# Altium project Timingcard_PROJECT.PrjPcb
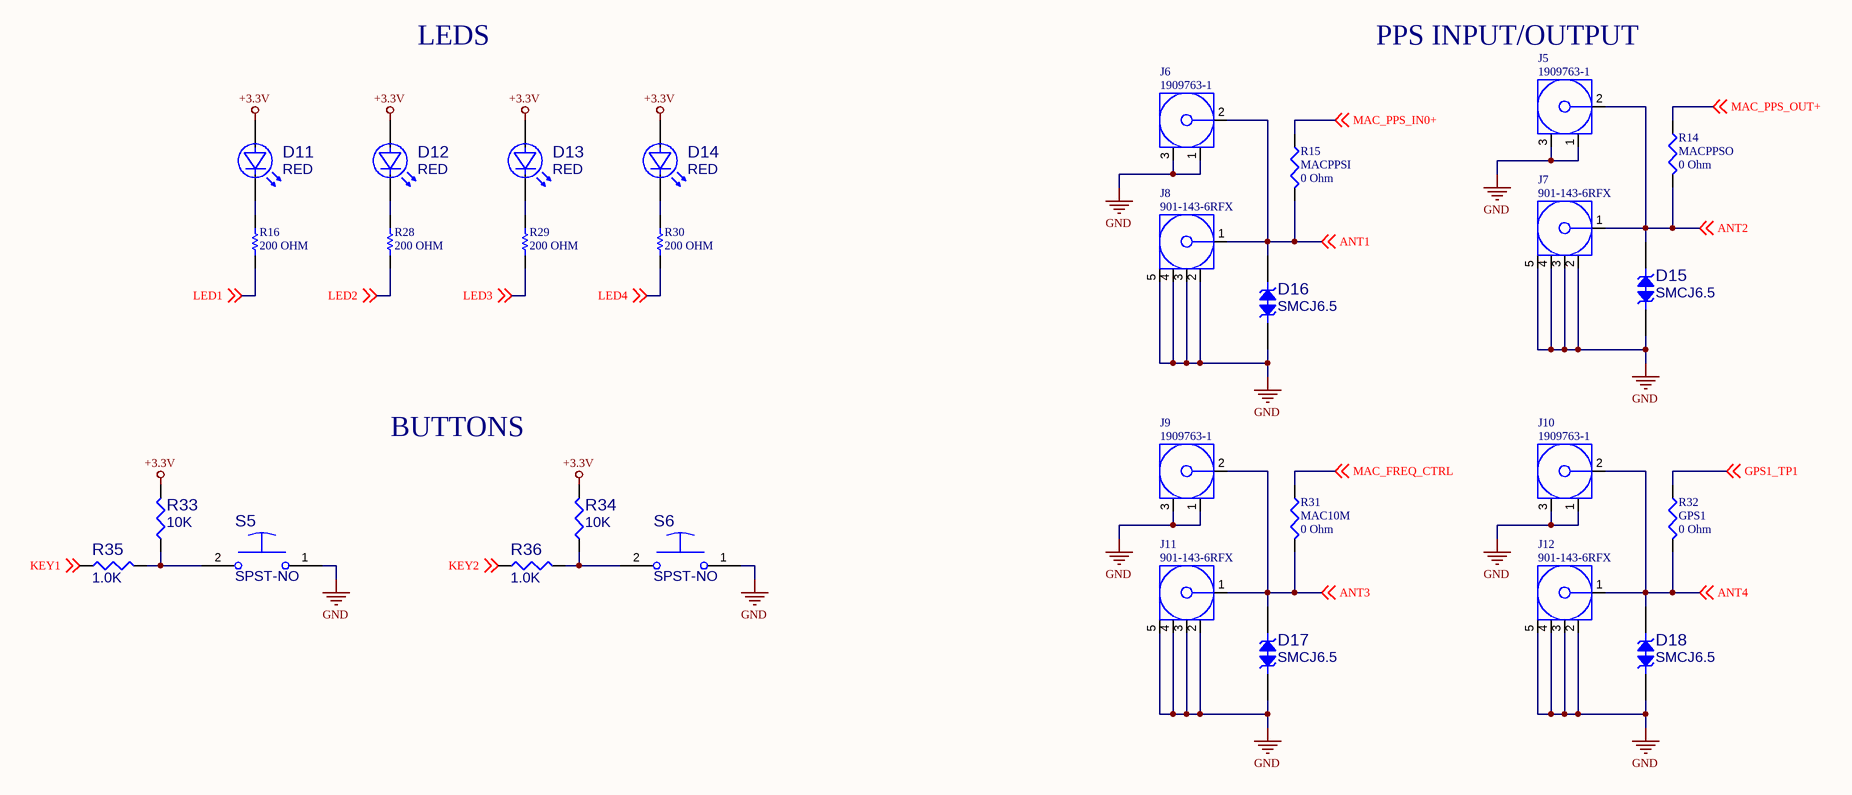
[diagram p0: USER_IO.SchDoc]
4 sheets, 106 parts. Net scope: global (net labels, ports and power ports of the same name join across sheets).
Board file: Timingcard_PCB.PcbDoc
Sheets:
  USER_IO.SchDoc
  POWER.SchDoc
  MAC.SchDoc
  FPGA.SchDoc

## Sheet USER_IO.SchDoc
size Tabloid; SheetNumber: 1; SheetTotal: 7

### Parts
D11  RED  [DIOM1608X06N]
D12  RED  [DIOM1608X06N]
D13  RED  [DIOM1608X06N]
D14  RED  [DIOM1608X06N]
D15  value SMCJ6.5  [DIOM6959X26N]  (hidden comment: SMCJ6.5CA)
D16  value SMCJ6.5  [DIOM6959X26N]  (hidden comment: SMCJ6.5CA)
D17  value SMCJ6.5  [DIOM6959X26N]  (hidden comment: SMCJ6.5CA)
D18  value SMCJ6.5  [DIOM6959X26N]  (hidden comment: SMCJ6.5CA)
J5  1909763-1  [TECO-1909763-1_V]
J6  1909763-1  [TECO-1909763-1_V]
J7  901-143-6RFX  [AMPH-901-143-6RFX_V]
J8  901-143-6RFX  [AMPH-901-143-6RFX_V]
J9  1909763-1  [TECO-1909763-1_V]
J10  1909763-1  [TECO-1909763-1_V]
J11  901-143-6RFX  [AMPH-901-143-6RFX_V]
J12  901-143-6RFX  [AMPH-901-143-6RFX_V]
R14  MACPPSO  value 0 Ohm  [J1-0603]
R15  MACPPSI  value 0 Ohm  [J1-0603]
R16  200 OHM  [RESC1608X55X30NL15T15]
R28  200 OHM  [RESC1608X55X30NL15T15]
R29  200 OHM  [RESC1608X55X30NL15T15]
R30  200 OHM  [RESC1608X55X30NL15T15]
R31  MAC10M  value 0 Ohm  [J1-0603]
R32  GPS1  value 0 Ohm  [J1-0603]
R33  value 10K  [RESC1608X50N]  (hidden comment: ERJ-3EKF1002V)
R34  value 10K  [RESC1608X50N]  (hidden comment: ERJ-3EKF1002V)
R35  value 1.0K  [RESC1608X50N]  (hidden comment: ERJ-3EKF1001V)
R36  value 1.0K  [RESC1608X50N]  (hidden comment: ERJ-3EKF1001V)
S5  value SPST-NO  [OMRON-B3U-1000P]  (hidden comment: B3U-1000P)
S6  value SPST-NO  [OMRON-B3U-1000P]  (hidden comment: B3U-1000P)

### Nets
+3.3V: D11.2(A) D12.2(A) D13.2(A) D14.2(A) R33.2 R34.2
GND: D15.K D16.K D17.K D18.K J5.1 J5.3 J6.1 J6.3 J7.2 J7.3 J7.4 J7.5 J8.2 J8.3 J8.4 J8.5 J9.1 J9.3 J10.1 J10.3 J11.2 J11.3 J11.4 J11.5 J12.2 J12.3 J12.4 J12.5 S5.1 S6.1
ANT1: D16.A J6.2 J8.1 R15.2 ; off-sheet ANT1
ANT2: D15.A J5.2 J7.1 R14.2 ; off-sheet ANT2
ANT3: D17.A J9.2 J11.1 R31.2 ; off-sheet ANT3
ANT4: D18.A J10.2 J12.1 R32.2 ; off-sheet ANT4
GPS1_TP1: R32.1 ; off-sheet GPS1_TP1
KEY1: R35.1 ; off-sheet KEY1
KEY2: R36.1 ; off-sheet KEY2
LED1: R16.1 ; off-sheet LED1
LED2: R28.1 ; off-sheet LED2
LED3: R29.1 ; off-sheet LED3
LED4: R30.1 ; off-sheet LED4
MAC_FREQ_CTRL: R31.1 ; off-sheet MAC_FREQ_CTRL  [project net MAC_10Mout]
MAC_PPS_IN0+: R15.1 ; off-sheet MAC_PPS_IN0+
MAC_PPS_OUT+: R14.1 ; off-sheet MAC_PPS_OUT+
NetD11_1: D11.1(K) R16.2
NetD12_1: D12.1(K) R28.2
NetD13_1: D13.1(K) R29.2
NetD14_1: D14.1(K) R30.2
NetR33_1: R33.1 R35.2 S5.2
NetR34_1: R34.1 R36.2 S6.2

### Notes on the sheet
- LEDS
- PPS INPUT/OUTPUT
- BUTTONS
- SHEET
- timingcard.com <http://timingcard.com>
- OF

### Library data of the parts
D11-D14 = SMTLED_RED_0603_SML: LED, RED, SML-LX0603, 635NM, 2V, 20MA, 0603; MFG PART NUM: SML-LX0603IW-TR; VALENTIUM PART NUM: <VALENTIUM>; MFG NAME: LUMEX; MAXTEMP: 85C; MINTEMP: -25C; MODIFY DATE: 9/4/2013; CATEGORY: LED; OTHER: SML-LX0603; P1: 635NM; P2: 2V; P3: 20MA; SIZE: 0603; SHEETPART: *; DESC: LED, RED, SML-LX0603, 635NM, 2V, 20MA, 0603; Supplier 1: Digi-Key; Supplier Part Number 1: 67-1548-1-ND; VALUE: RED
D15-D18 = SMCJ6.5CA: DIO, TVS, SMCJ6.5, 6.5V, BIDIR, 1.5KW, SMC; VALENTIUM PART NUM: <VALENTIUM>; MFG NAME: LITTELFUSE; MAXTEMP: 150C; MINTEMP: -55C; OTHER: SMCJ; MFG PART NUM: SMCJ6.5CA; MODIFY DATE: 9/4/2013; CATEGORY: DIO, TVS; P1: 6.5V; P2: BIDIR; P3: 1.5KW; SIZE: SMC; SHEETPART: *; Supplier 1: Digi-Key; Supplier Part Number 1: SMCJ6.5CALFCT-ND; DESC: DIO, TVS, SMCJ6.5, 6.5V, BIDIR, 1.5KW, SMC
J5 J6 J9 J10 = CMP-2000-07505-1: Ultra Miniature Coaxial Connector Jack, 60 V, 50 Ohm, -40 to 90 degC, RoHS, Tape and Reel; Manufacturer: TE Connectivity; Gender: Female; PCB Mounting Orientation: Vertical; Body Material: LiquidCrystalPolymer; Case\/Package: SMD/SMT; Impedance: 50Ohm; Max Frequency: 6GHz; Body Plating: Gold; Dielectric Material: Polymer; Orientation: Straight; Mount: SurfaceMount; Length: 3mm; Packaging: TapeandReel; Connector Type: Jack; Lead Free: LeadFree; Package Quantity: 1; Termination: SMD/SMT; Contact Material: CopperAlloy; Fastening Type: Pull; RoHSCompliant: true; Max Operating Temperature: 90degC; Datasheet URL: http://www.te.com/commerce/DocumentDelivery/DDEController?Action=srchrtrv&DocNm=1909763&DocType=Customer+Drawing&DocLang=English; Contact Plating: Gold; Mounting Technology: SurfaceMount; Package Reference: TECO-1909763-1; Insulation Material: Thermoplastic; Min Operating Temperature: -40degC; Manufacturer URL: http://www.te.com/; ELV: Compliant; Datasheet Version: Rev. B2, 11/2015; Radiation Hardening: No; Package Description: 3-Pin Surface Mount Device, Body 2.6 x 2.6 mm; Housing Colour: Beige
J7 J8 J11 J12 = CMP-2000-05705-1: Coaxial connector, 50 Ohm, -65 to 165 degC, 5-Pin THD, RoHS, Bulk; Manufacturer: Amphenol; Catalog Drawings: 901-143-6RFXMountingHole; 3D Model: 901-143-6RFX.igs; Body Material: Brass; Connector Type: Jack,FemaleSocket; Shield Termination: Solder; Other Names: 901-143-6-RFX9011436RFXARFX1232; Online Catalog: SMA,RFX; Frequency - Max: 18GHz; Body Finish: Gold; Dielectric Material: Polytetrafluoroethylene(PTFE); Center Contact Material: BerylliumCopper; Impedance: 50Ohm; Connector Style: SMA; Mounting Technology: ThroughHole; Mounting Type: ThroughHole,RightAngle; Cable Group: -; Series: -; Package Description: 5-Pin Through Hole Device, Body 7 x 7 mm, Pitch 2.54 mm; Package Reference: 901-143-6RFX; Voltage Rating: -; Standard Package: 1; Fastening Type: Threaded; Housing Color: Gold; Datasheet URL: http://www.amphenolrf.com/downloads/dl/file/id/2712/product/3102/901_143_6rfx_customer_drawing.pdf; Family: CoaxialConnectors(RF); Contact Termination: Solder; Manufacturer URL: http://www.amphenol.com/; Operating Temperature: -65°C~165°C; Category: Connectors,Interconnects; Packaging: Bulk; Features: -; Center Contact Plating: Gold; Datasheet Version: Rev. C, 06/2010; Ingress Protection: -
R14 R15 R31 R32 = Res3: Resistor; Published: 8-Jun-2000; LatestRevisionDate: 29-May-2009; LatestRevisionNote: IPC-7351 Footprint Added.; PackageReference: J1-0603; Publisher: Altium Limited; PackageDescription: Chip Resistor
R16 R28-R30 = CMP-2000-00316-1: ERJ-3EKF2000V; Manufacturer: Panasonic; Part Number: ERJ-3EKF2000V
R33 R34 = RES_0603_10K: RES, 10K, 1%, 1/10W, TF, 0603; VELENTIUM PART NUM: <VELENTIUM>; MFG NAME: PANASONIC; MAXTEMP: 125C; MINTEMP: -55C; OTHER: 100PPM; SUB: GENERIC; ModifyDate: 7/25/2013; MFG PART NUM: ERJ-3EKF1002V; CATEGORY: RES; Date: 7/26/2013; P1: 1%; P3: TF; P2: 1/10W; SIZE: 0603; Supplier 1: Digi-Key; Supplier Part Number 1: P10.0KHCT-ND; SHEETPART: *; DESC: RES, 10K, 1%, 1/10W, TF, 0603
R35 R36 = RES_0603_1.0K: RES, 1.0K, 1%, 1/10W, TF, 0603; VELENTIUM PART NUM: <VELENTIUM>; MFG NAME: PANASONIC; MAXTEMP: 125C; MINTEMP: -55C; OTHER: 100PPM; SUB: GENERIC; ModifyDate: 7/25/2013; MFG PART NUM: ERJ-3EKF1001V; CATEGORY: RES; Date: 7/26/2013; P1: 1%; P3: TF; P2: 1/10W; SIZE: 0603; Supplier 1: Digi-Key; Supplier Part Number 1: P1.00KHCT-ND; SHEETPART: *; DESC: RES, 1.0K, 1%, 1/10W, TF, 0603
S5 S6 = B3U-1000P: SW, SPST-NO, TACT, 12V, 50MA, 3X2.5MM SMT, B3U SERIES; VALENTIUM PART NUM: <VALENTIUM>; MFG NAME: OMRON; MAXTEMP: 70C; MINTEMP: -25C; MFG PART NUM: B3U-1000P; MODIFY DATE: 9/5/2013; CATEGORY: SW; OTHER: B3U SERIES; P1: 12V; P2: 50mA; P3: TACT; SIZE: 3X2.5MM; SHEETPART: *; DESC: SW, SPST-NO, TACT, 12V, 50MA, 3X2.5MM SMT, B3U SERIES; Supplier 1: Digi-Key; Supplier Part Number 1: SW1020CT-ND

## Sheet POWER.SchDoc: Grandmaster Power Supplies
size Tabloid; Author: N Smith; Revision: A; SheetNumber: 2; SheetTotal: 7; Customer: 01910
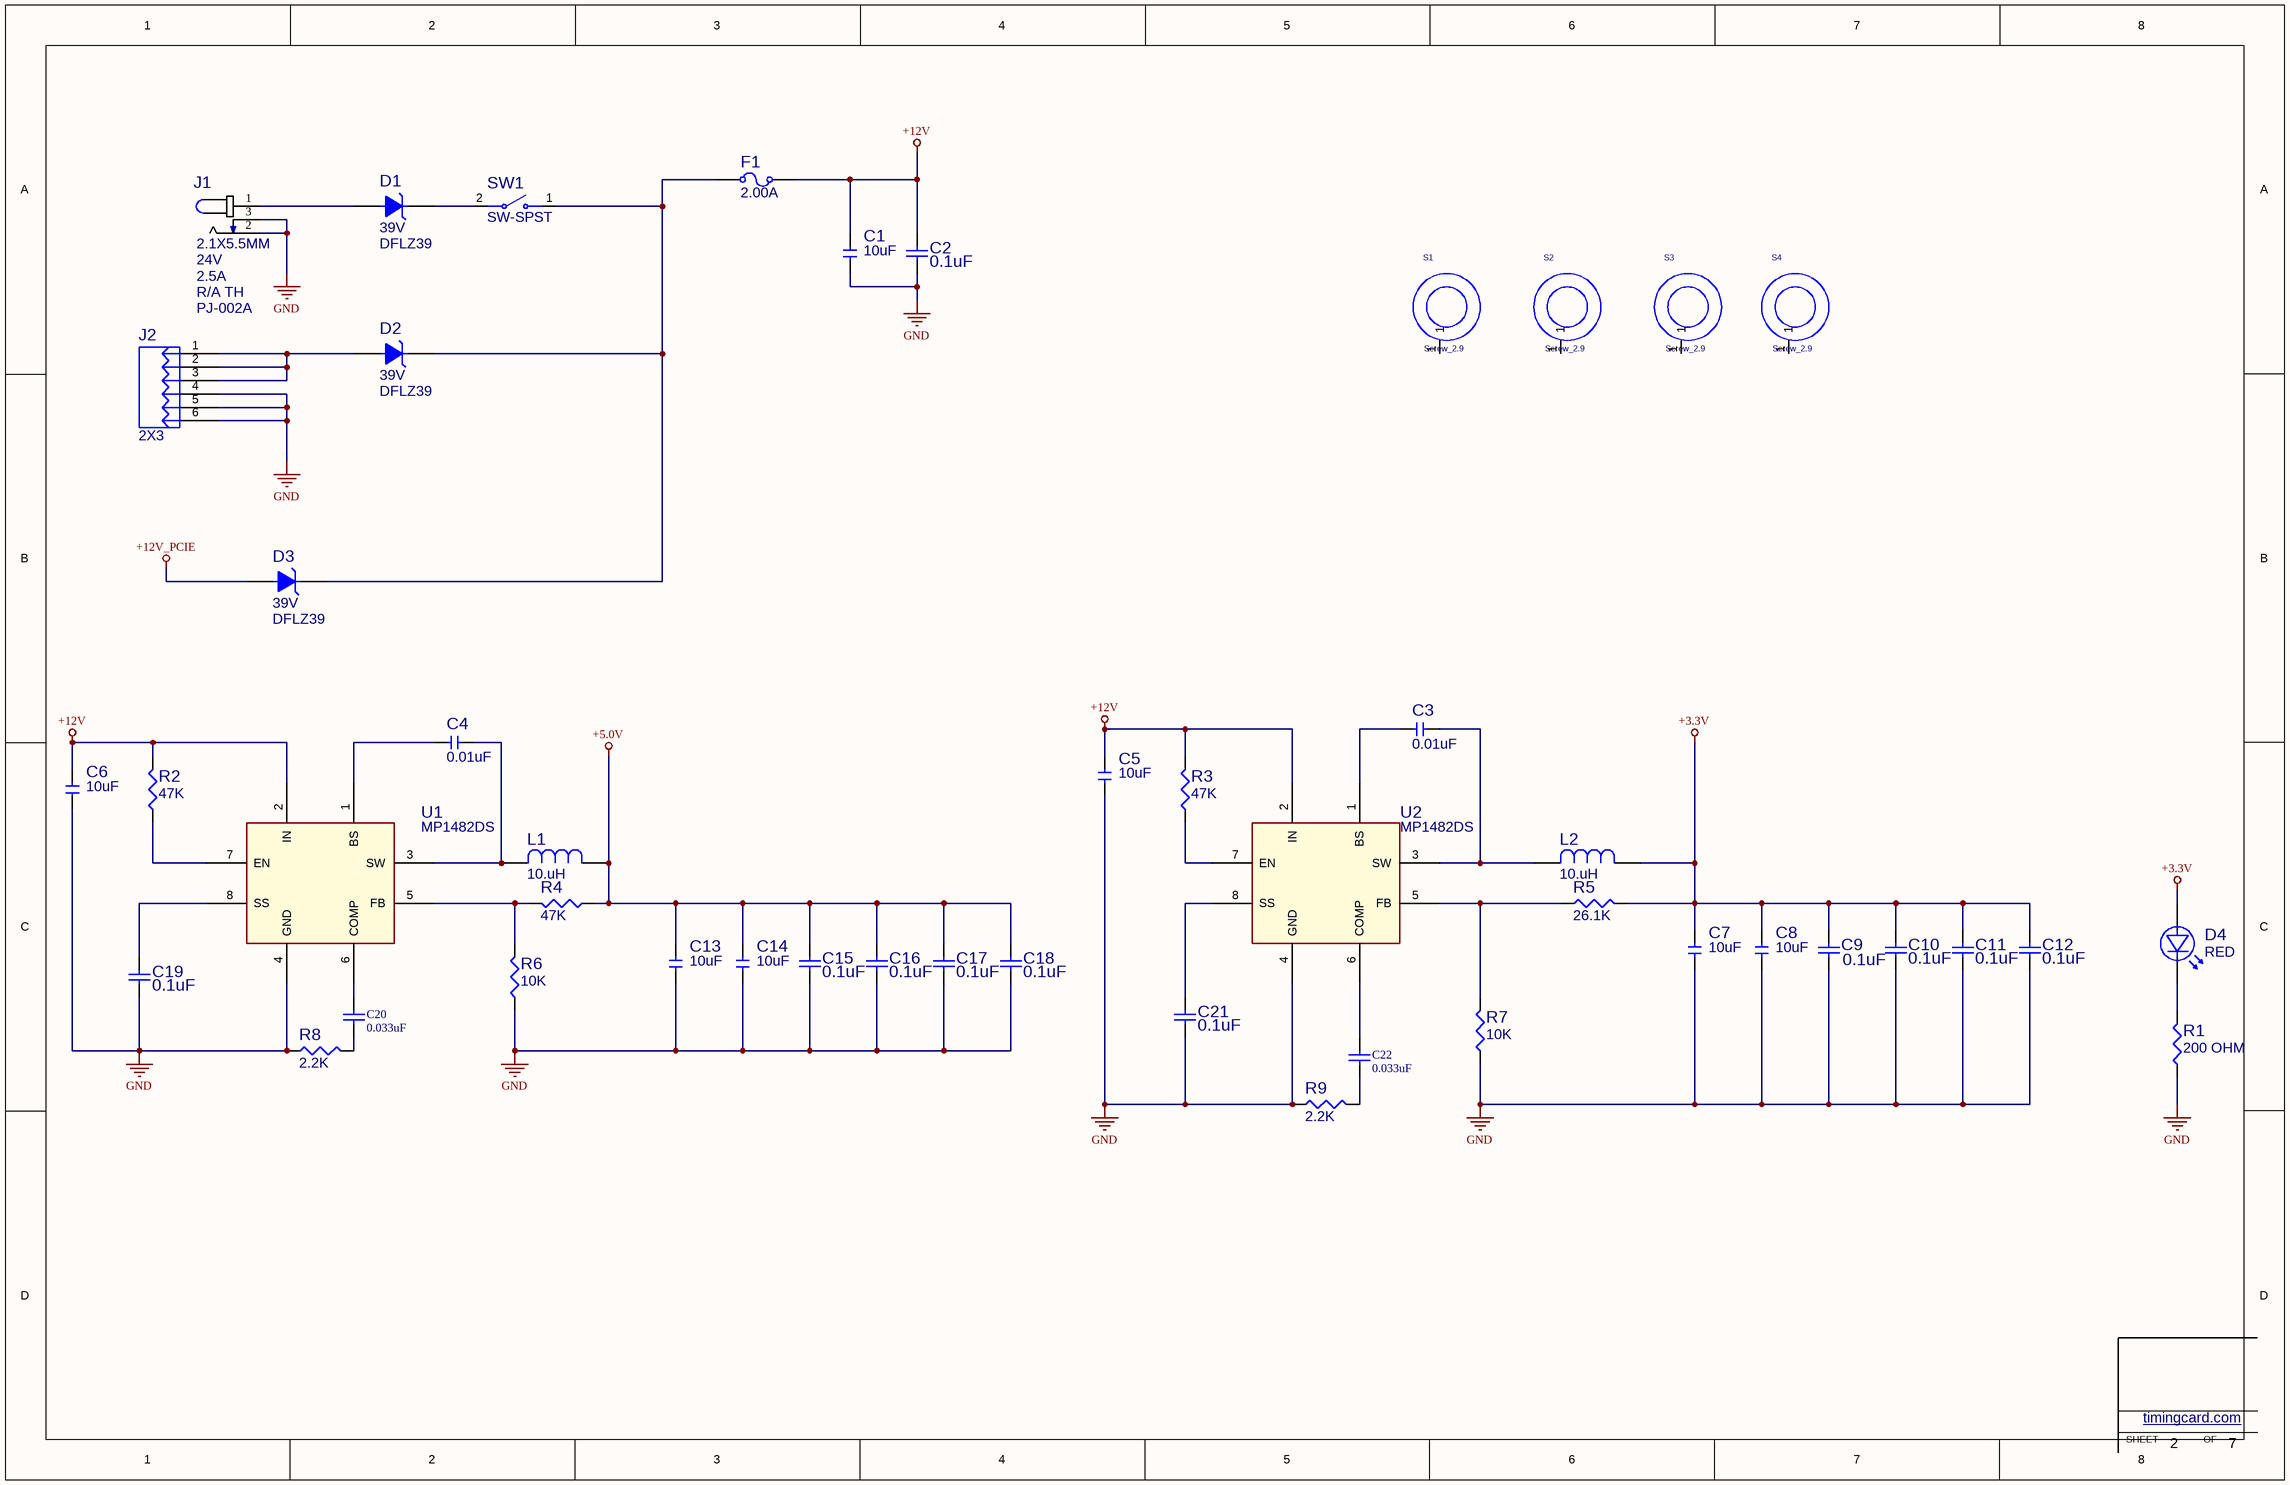
[diagram p1: POWER.SchDoc]

### Parts
C1  value 10uF  [CAPC2012X14N]  (hidden comment: CAP_0805_10UF_25V)
C2  0.1uF  [CAPC1608X87X45ML20T05]
C3  value 0.01uF  [CAPC1608X10N]  (hidden comment: CAP_0603_0.01UF_50V)
C4  value 0.01uF  [CAPC1608X10N]  (hidden comment: CAP_0603_0.01UF_50V)
C5  value 10uF  [CAPC2012X14N]  (hidden comment: CAP_0805_10UF_25V)
C6  value 10uF  [CAPC2012X14N]  (hidden comment: CAP_0805_10UF_25V)
C7  value 10uF  [CAPC2012X14N]  (hidden comment: CAP_0805_10UF_25V)
C8  value 10uF  [CAPC2012X14N]  (hidden comment: CAP_0805_10UF_25V)
C9  0.1uF  [CAPC1608X87X45ML20T05]
C10  0.1uF  [CAPC1608X87X45ML20T05]
C11  0.1uF  [CAPC1608X87X45ML20T05]
C12  0.1uF  [CAPC1608X87X45ML20T05]
C13  value 10uF  [CAPC2012X14N]  (hidden comment: CAP_0805_10UF_25V)
C14  value 10uF  [CAPC2012X14N]  (hidden comment: CAP_0805_10UF_25V)
C15  0.1uF  [CAPC1608X87X45ML20T05]
C16  0.1uF  [CAPC1608X87X45ML20T05]
C17  0.1uF  [CAPC1608X87X45ML20T05]
C18  0.1uF  [CAPC1608X87X45ML20T05]
C19  0.1uF  [CAPC1608X87X45ML20T05]
C20  0.033uF  [CAPC1608X90X35NL10T15]
C21  0.1uF  [CAPC1608X87X45ML20T05]
C22  0.033uF  [CAPC1608X90X35NL10T15]
D1  value DFLZ39  P1: 39V  [SODFL370X135-2N]  (hidden comment: DFLZ39-TP)
D2  value DFLZ39  P1: 39V  [SODFL370X135-2N]  (hidden comment: DFLZ39-TP)
D3  value DFLZ39  P1: 39V  [SODFL370X135-2N]  (hidden comment: DFLZ39-TP)
D4  RED  [DIOM1608X06N]
F1  value 2.00A  [FUSM1608X60N]  (hidden comment: FUSE_0603_2.00A)
J1  P1: 2.1X5.5MM  P2: 24V  P3: 2.5A  SIZE: R/A TH  [CUI_PJ-002A]  (hidden comment: PJ-002A)
J2  value 2X3  [39-30-1060]  (hidden comment: 39-30-1060)
L1  value 10.uH  [IND_PM124SH]  (hidden comment: PM124SH-100M-RC)
L2  value 10.uH  [IND_PM124SH]  (hidden comment: PM124SH-100M-RC)
R1  value 200 OHM  [RESC1608X50N]  (hidden comment: ERJ-3EKF2000V)
R2  value 47K  [RESC1608X50N]  (hidden comment: ERJ-3EKF4702V)
R3  value 47K  [RESC1608X50N]  (hidden comment: ERJ-3EKF4702V)
R4  value 47K  [RESC1608X50N]  (hidden comment: ERJ-3EKF4702V)
R5  value 26.1K  [RESC1608X50N]  (hidden comment: ERJ-3EKF2612V)
R6  value 10K  [RESC1608X50N]  (hidden comment: ERJ-3EKF1002V)
R7  value 10K  [RESC1608X50N]  (hidden comment: ERJ-3EKF1002V)
R8  value 2.2K  [RESC1608X50N]  (hidden comment: ERJ-3EKF2201V)
R9  value 2.2K  [RESC1608X50N]  (hidden comment: ERJ-3EKF2201V)
S1  Screw_2.9  [MH_250H125]
S2  Screw_2.9  [MH_250H125]
S3  Screw_2.9  [MH_250H125]
S4  Screw_2.9  [MH_250H125]
SW1  value SW-SPST  [L101011MS02Q]  (hidden comment: L101011MS02Q)
U1  value MP1482DS  [SOIC127P600X175-8N]  (hidden comment: MP1482DS-LF)
U2  value MP1482DS  [SOIC127P600X175-8N]  (hidden comment: MP1482DS-LF)

### Nets
+3.3V: C7.1 C8.1 C9.2 C10.2 C11.2 C12.2 D4.2(A) L2.1 R5.2
+5.0V: C13.1 C14.1 C15.2 C16.2 C17.2 C18.2 L1.1 R4.1
+12V: C1.1 C2.2 C5.1 C6.1 F1.2 R2.2 R3.2 U1.2(IN) U2.2(IN)
+12V_PCIE: D3.2(A)
GND: C1.2 C2.1 C5.2 C6.2 C7.2 C8.2 C9.1 C10.1 C11.1 C12.1 C13.2 C14.2 C15.1 C16.1 C17.1 C18.1 C19.1 C21.1 J1.2 J1.3 J2.4 J2.5 J2.6 R1.1 R6.1 R7.1 R8.1 R9.1 U1.4(GND) U2.4(GND)
NetC3_1: C3.1 U2.1(BS)
NetC3_2: C3.2 L2.2 U2.3(SW)
NetC4_1: C4.1 U1.1(BS)
NetC4_2: C4.2 L1.2 U1.3(SW)
NetC19_2: C19.2 U1.8(SS)
NetC20_1: C20.1 R8.2
NetC20_2: C20.2 U1.6(COMP)
NetC21_2: C21.2 U2.8(SS)
NetC22_1: C22.1 R9.2
NetC22_2: C22.2 U2.6(COMP)
NetD1_1: D1.1(C) SW1.2
NetD1_2: D1.2(A) J1.1
NetD2_1: D2.1(C) D3.1(C) F1.1 SW1.1
NetD2_2: D2.2(A) J2.1 J2.2 J2.3
NetD4_1: D4.1(K) R1.2
NetR2_1: R2.1 U1.7(EN)
NetR3_1: R3.1 U2.7(EN)
NetR4_2: R4.2 R6.2 U1.5(FB)
NetR5_1: R5.1 R7.2 U2.5(FB)

Not connected (* = marked no-connect by the designer): S1 1; S2 1; S3 1; S4 1

### Notes on the sheet
- SHEET
- timingcard.com <http://timingcard.com>
- OF

### Library data of the parts
C1 C5-C8 C13 C14 = CAP_0805_10UF_25V: CAP, CER, 10.UF, 25V, 10%, X5R, 0805; MFG PART NUM: TMK212BBJ106KG-T; VALENTIUM PART NUM: <VALENTIUM>; MFG NAME: TAIYO YUDEN; MAXTEMP: 85C; MINTEMP: -55C; DESC: CAP, CER, 10.UF, 10V, 10%, X5R, 0805; MODIFY DATE: 10/23/2013; CATEGORY: CAP, CER; Date: 4/11/2006 3:37:28 PM; SHEETPART: *; P1: 10%; P2: 25V; P3: X5R; Size: 0805; Supplier 1: MOUSER; Supplier Part Number 1: 963-TMK212BBJ106KG-T
C2 C9-C12 C15-C19 C21 = CMP-2006-00003-1: C0603X104K5RACAUTO; Manufacturer: Kemet; Part Number: C0603X104K5RACAUTO
C3 C4 = CAP_0603_0.01UF_50V: CAP, CER, 0.01UF, 50V, 10%, X7R, 0603; MFG PART NUM: C0603C103K5RACTU; VALENTIUM PART NUM: <VALENTIUM>; MFG NAME: KEMET; MAXTEMP: 125C; MINTEMP: -55C; CATEGORY: CAP, CER; MODIFY DATE: 10/23/2013; Date: 7/24/2013; SHEETPART: *; P1: 10%; P2: 50V; P3: X7R; Size: 0603; Supplier 1: Digi-Key; Supplier Part Number 1: 399-1091-1-ND; DESC: CAP, CER, 0.01UF, 50V, 10%, X7R, 0603
C20 C22 = CMP-2006-02385-1: GCM188R71H333KA55D; Manufacturer: Murata; Part Number: GCM188R71H333KA55D
D1-D3 = DFLZ39: DIO, ZENER, DFLZ39, 39V, 5%, 1W, SOD123FL; VALENTIUM PART NUM: <VALENTIUM>; MFG NAME: MICRO COMM; MAXTEMP: 150C; MINTEMP: -55C; OTHER: SERIES; MFG PART NUM: DFLZ39-TP; MODIFY DATE: 9/4/2013; CATEGORY: DIO, ZENER; P2: 5%; P3: 1W; SIZE: SOD123FL; SHEETPART: *; DESC: DIO, ZENER, DFLZ39, 39V, 5%, 1W, SOD123FL; Supplier 1: Digi-Key; Supplier Part Number 1: DFLZ39-TPMSDKR-ND
D4 = SMTLED_RED_0603_SML: as D11 on sheet USER_IO; MODIFY DATE: 9/4/2013; CATEGORY: LED; OTHER: SML-LX0603; P1: 635NM; P2: 2V; P3: 20MA; SIZE: 0603; SHEETPART: *; DESC: LED, RED, SML-LX0603, 635NM, 2V, 20MA, 0603; Supplier 1: Digi-Key; Supplier Part Number 1: 67-1548-1-ND; VALUE: RED
F1 = FUSE_0603_2.00A: FUSE SLOW 2.00A 32V M 0603; MFG PART NUM: SF-0603S200-2; VALENTIUM PART NUM: <VALENTIUM>; MFG NAME: BOURNS; MAXTEMP: 105C; MINTEMP: -40C; OTHER: UL E141069; P1: SLOW BLO; DESC: FUSE SLOW 1.25A 32V M 0603; MODIFY DATE: 9/4/2013; CATEGORY: FUSE; DATE: 20 OCT 15; P2: 32V; P3: M; SIZE: 0603; SHEETPART: *; Supplier 1: Digi-Key; Supplier Part Number 1: SF-0603S200-2CT-ND
J1 = PJ-002A: CONN, JACK, PJ-002A, 2.1X5.5MM, 24V 2.5A, R/A TH, SPST-NC; VALENTIUM PART NUM: <VALENTIUM>; MAXTEMP: 85C; MFG NAME: CUI DEVICES; MINTEMP: -25C; CATEGORY: CONN, JACK; DESC: CONN, JACK, PJ-002A, 2.1X5.5MM, 24V 2.5A, R/A TH, SPST-NC; MFG PART NUM: PJ-002A; OTHER: SPST-NC; Supplier 1: Digi-Key; Supplier Part Number 1: CP-002A-ND; Value: PJ-002A
J2 = 39-30-1060: CONN, HDR, 2X3, R/A, 4.2MM, TH, MINI-FIT JR; MFG PART NUM: 105314-1206; VALENTIUM PART NUM: <VALENTIUM>; MFG NAME: MOLEX; MAXTEMP: 105C; MINTEMP: -40C; OTHER: NANO-FIT; P2: 2.5MM; DESC: CONN, HDR, 2X3, R/A, 2.5MM, TH, NANO-FIT; MODIFY DATE: 10/10/2013; CATEGORY: CONN, HDR; P1: R/A; SIZE: TH; Supplier 1: Digi-Key; Supplier Part Number 1: WM14977-ND
L1 L2 = PM124SH-100M-RC: IND, PWR, 10.uH, 20%, 4A, 0.04DCR, 12.5X12.5MM, SHLD; VALENTIUM PART NUM: <VALENTIUM>; MFG NAME: BOURNS; MAXTEMP: 125C; MINTEMP: -40C; P3: 36mOhm; MFG PART NUM: PM124SH-100M-RC; MODIFY DATE: 10/23/2013; Date: 10/23/2013; CATEGORY: IND, PWR; OTHER: SHLD; P1: 20%; P2: 4A; SIZE: 12.5X12.5MM; SHEETPART: *; DESC: IND, PWR, 10.uH, 20%, 4A, 0.04DCR, 12.5X12.5MM, SHLD; Supplier 1: Digi-Key; Supplier Part Number 1: PM124SH-100M-RCCT-ND
R1 = RES_0603_200: RES, 200 OHM, 1%, 1/10W, TF, 0603; VELENTIUM PART NUM: <VELENTIUM>; MFG NAME: PANASONIC; MAXTEMP: 125C; MINTEMP: -55C; OTHER: 100PPM; SUB: GENERIC; ModifyDate: 7/25/2013; MFG PART NUM: ERJ-3EKF2000V; CATEGORY: RES; Date: 7/26/2013; P1: 1%; P3: TF; P2: 1/10W; SIZE: 0603; SHEETPART: *; DESC: RES, 200 OHM, 1%, 1/10W, TF, 0603; Supplier 1: Digi-Key; Supplier Part Number 1: P200HCT-ND
R2-R4 = RES_0603_47K: RES, 47K, 1%, 1/10W, TF, 0603; VELENTIUM PART NUM: <VELENTIUM>; MFG NAME: PANASONIC; MAXTEMP: 125C; MINTEMP: -55C; OTHER: 100PPM; SUB: GENERIC; ModifyDate: 1/22/2014; MFG PART NUM: ERJ-3EKF4702V; CATEGORY: RES; Date: 1/22/2014; P1: 1%; P3: TF; P2: 1/10W; SIZE: 0603; SHEETPART: *; DESC: RES, 47K, 1%, 1/10W, TF, 0603; Supplier 1: Digi-Key; Supplier Part Number 1: P47.0KHCT-ND
R5 = RES_0603_26.1K: RES, 26.1K, 1%, 1/10W, TF, 0603; VELENTIUM PART NUM: <VELENTIUM>; MFG NAME: PANASONIC; MAXTEMP: 125C; MINTEMP: -55C; OTHER: 100PPM; SUB: GENERIC; DESC: RES, 27.1K, 1%, 1/10W, TF, 0603; ModifyDate: 7/25/2013; MFG PART NUM: ERJ-3EKF2612V; CATEGORY: RES; Date: 7/26/2013; P1: 1%; P3: TF; P2: 1/10W; SIZE: 0603; SHEETPART: *; Supplier 1: Digi-Key; Supplier Part Number 1: P26.1KHCT-ND
R6 R7 = RES_0603_10K: as R33 on sheet USER_IO; ModifyDate: 7/25/2013; MFG PART NUM: ERJ-3EKF1002V; CATEGORY: RES; Date: 7/26/2013; P1: 1%; P3: TF; P2: 1/10W; SIZE: 0603; Supplier 1: Digi-Key; Supplier Part Number 1: P10.0KHCT-ND; SHEETPART: *; DESC: RES, 10K, 1%, 1/10W, TF, 0603
R8 R9 = RES_0603_2.2K: RES, 2.2K, 1%, 1/10W, TF, 0603; VELENTIUM PART NUM: <VELENTIUM>; MFG NAME: PANASONIC; MAXTEMP: 125C; MINTEMP: -55C; OTHER: 100PPM; SUB: GENERIC; ModifyDate: 8/15/2013; MFG PART NUM: ERJ-3EKF2201V; CATEGORY: RES; Date: 8/15/2013; P1: 1%; P3: TF; P2: 1/10W; SIZE: 0603; Supplier 1: Digi-Key; Supplier Part Number 1: P2.20KHCT-ND; SHEETPART: *; DESC: RES, 2.2K, 1%, 1/10W, TF, 0603
S1-S4 = screw_0: FH140 Screw,Diameter 2.9mm; Part Number: 454; Manufacturer: NA; Vendor P/N: NA; Part Type: SMT
SW1 = L101011MS02Q: SW, SPST, 250V, 2A, SLIDE, ON-OFF, TH; VALENTIUM PART NUM: <VALENTIUM>; MFG NAME: C&K; MAXTEMP: 85C; MINTEMP: -25C; MFG PART NUM: L101011MS02Q; MODIFY DATE: 1/21/2014; CATEGORY: SW; DATE: 9/5/2013; OTHER: L101011MS02Q; P1: 250V; P2: 2A; P3: SW, SPST, 250V, 2A, SLIDE, ON-OFF, TH; SIZE: 19.1X10.79MM; SHEETPART: *; DESC: SW, SPST, 250V, 2A, SLIDE, ON-OFF, TH; Supplier 1: Digi-Key; Supplier Part Number 1: CKC5106-ND
U1 U2 = MP1482DS: IC, DC/DC, MP1482DS, >4.75VIN, 0.923-15V OUT, SOIC8; VELENTIUM PART NUM: <V PART NUM>; MFG NAME: MPS; MAXTEMP: +85C; MINTEMP: -40C; OTHER: additional spec; P3: W; MFG PART NUM: MP1482DS-LF; MODIFY DATE: 12/27/2005 8:34:25 AM; CATEGORY: IC, DC/DC; P1: >4.75V IN; P2: 0.923-15V OUT; SIZE: 8SOIC; SHEETPART: *; DESC: IC, DC/DC, MP1482DS, >4.75VIN, 0.923-15V OUT, SOIC8; Supplier 1: Digi-Key; Supplier Part Number 1: 1589-1524-1-ND

## Sheet MAC.SchDoc: Grandmaster MAC & Clock Generation
size Tabloid; Author: N Smith; Revision: A; SheetNumber: 6; SheetTotal: 7; Customer: 01910
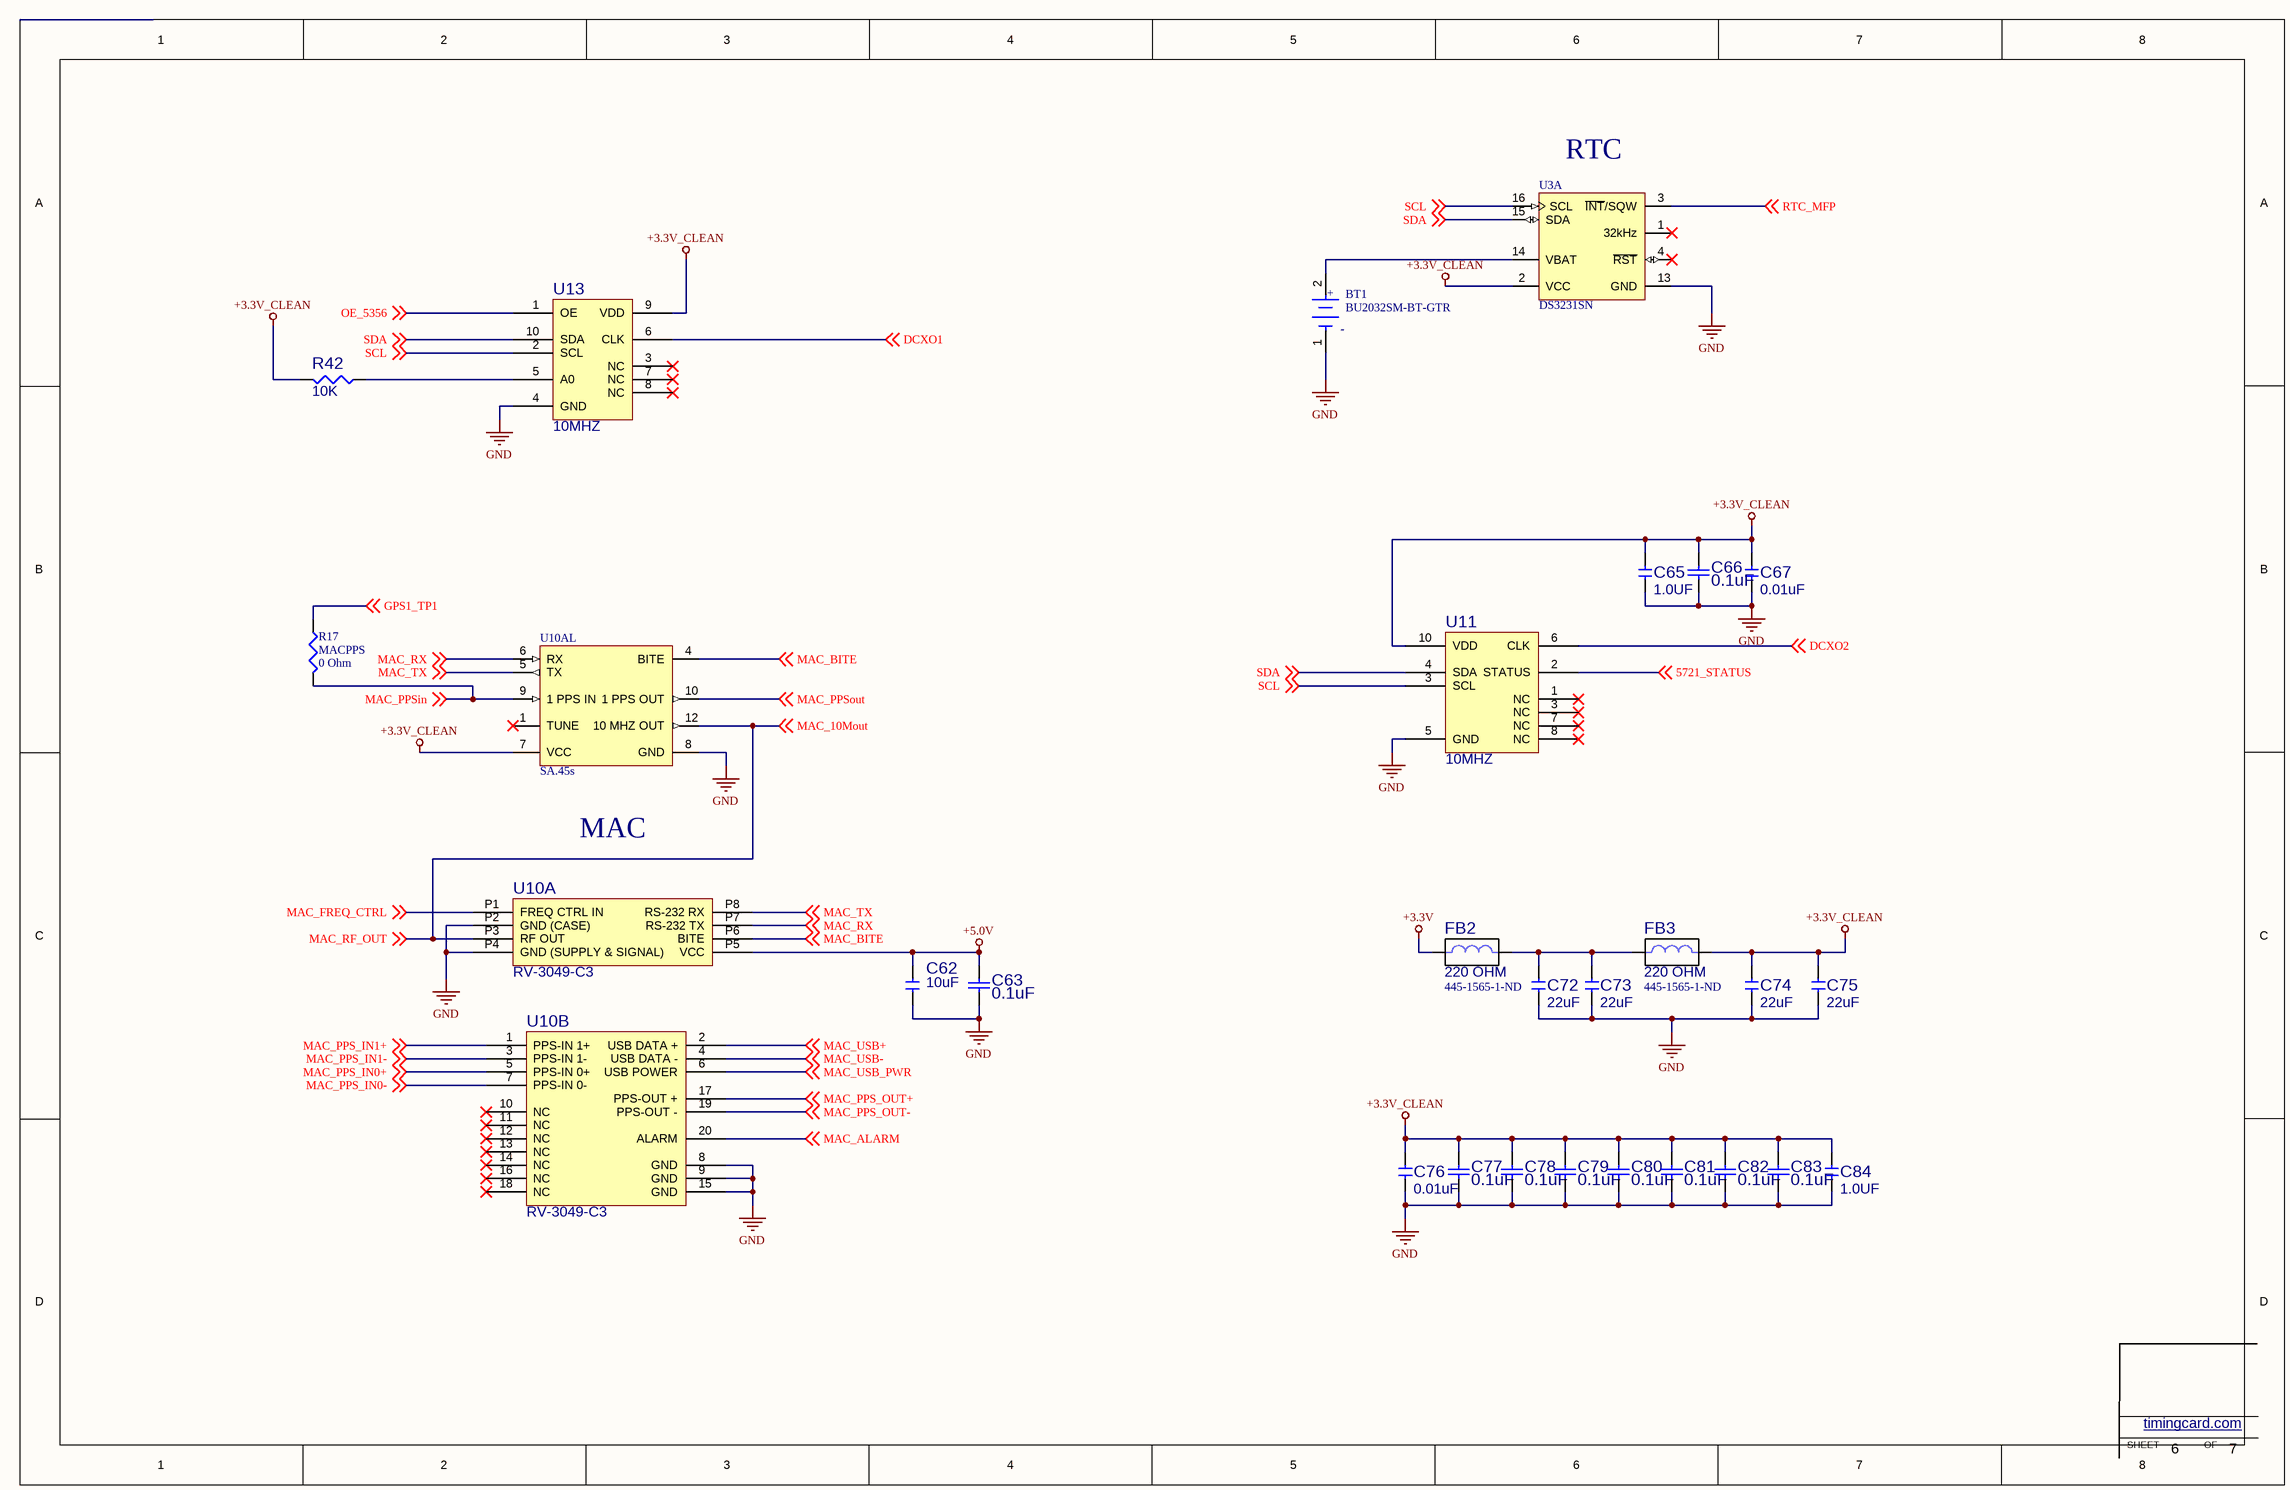
[diagram p2: MAC.SchDoc]

### Parts
BT1  BU2032SM-BT-GTR  [FP-BU2032SM-BT-GTR-MFG]
C62  value 10uF  [CAPC2012X14N]  (hidden comment: CAP_0805_10UF_25V)
C63  0.1uF  [CAPC1608X87X45ML20T05]
C65  value 1.0UF  [CAPC2012X14N]  (hidden comment: CAP_0805_1UF_50V)
C66  0.1uF  [CAPC1608X87X45ML20T05]
C67  value 0.01uF  [CAPC1608X10N]  (hidden comment: CAP_0603_0.01UF_50V)
C72  value 22uF  [CAPC2012X14N]  (hidden comment: CAP_0805_22UF_16V)
C73  value 22uF  [CAPC2012X14N]  (hidden comment: CAP_0805_22UF_16V)
C74  value 22uF  [CAPC2012X14N]  (hidden comment: CAP_0805_22UF_16V)
C75  value 22uF  [CAPC2012X14N]  (hidden comment: CAP_0805_22UF_16V)
C76  value 0.01uF  [CAPC1608X10N]  (hidden comment: CAP_0603_0.01UF_50V)
C77  0.1uF  [CAPC1608X87X45ML20T05]
C78  0.1uF  [CAPC1608X87X45ML20T05]
C79  0.1uF  [CAPC1608X87X45ML20T05]
C80  0.1uF  [CAPC1608X87X45ML20T05]
C81  0.1uF  [CAPC1608X87X45ML20T05]
C82  0.1uF  [CAPC1608X87X45ML20T05]
C83  0.1uF  [CAPC1608X87X45ML20T05]
C84  value 1.0UF  [CAPC2012X14N]  (hidden comment: CAP_0805_1UF_50V)
FB2  value 220 OHM  Supplier Part Number 1: 445-1565-1-ND  [INDC1608X09N]  (hidden comment: MPZ1608_220OHM_0603)
FB3  value 220 OHM  Supplier Part Number 1: 445-1565-1-ND  [INDC1608X09N]  (hidden comment: MPZ1608_220OHM_0603)
R17  MACPPS  value 0 Ohm  [J1-0603]
R42  value 10K  [RESC1608X50N]  (hidden comment: ERJ-3EKF1002V)
U3  DS3231SN  [W16-H2_L]  (part A of 2)
U10  value RV-3049-C3  [MAC-SA5X]  (hidden comment: MAC-SA5X)  (parts A,B of 2)
U10AL  SA.45s  [MCSM-090-02984-00X]
U11  value 10MHZ  [SIT5721]  (hidden comment: SiT5721AI-KWA33-T-10.000000)
U13  value 10MHZ  [SIT5155]  (hidden comment: SiT5356AI-FQA33-IT-10.000000)

### Nets
+3.3V: FB2.1
+3.3V_CLEAN: C65.2 C66.2 C67.2 C74.2 C75.2 C76.2 C77.2 C78.2 C79.2 C80.2 C81.2 C82.2 C83.2 C84.2 FB3.2 R42.2 U3.2(VCC) U10AL.7(VCC) U11.10(VDD) U13.9(VDD)
+5.0V: C62.1 C63.2 U10.P5(VCC)
GND: BT1.1(C) C62.2 C63.1 C65.1 C66.1 C67.1 C72.1 C73.1 C74.1 C75.1 C76.1 C77.1 C78.1 C79.1 C80.1 C81.1 C82.1 C83.1 C84.1 U3.13(GND) U10.8(GND) U10.9(GND) U10.15(GND) U10.P2(GND_(CASE)) U10.P4(GND_(SUPPLY_&_SIGNAL)) U10AL.8(GND) U11.5(GND) U13.4(GND)
5721_STATUS: U11.2(STATUS) ; off-sheet 5721_STATUS
DCXO1: U13.6(CLK) ; off-sheet DCXO1
DCXO2: U11.6(CLK) ; off-sheet DCXO2
GPS1_TP1: R17.1 ; off-sheet GPS1_TP1
MAC_10Mout: U10.P1(FREQ_CTRL_IN) U10.P3(RF_OUT) U10AL.12(10_MHZ_OUT) ; off-sheet MAC_RF_OUT, off-sheet MAC_FREQ_CTRL, off-sheet MAC_10Mout  [also labelled MAC_FREQ_CTRL, MAC_RF_OUT]
MAC_ALARM: U10.20(ALARM) ; off-sheet MAC_ALARM
MAC_BITE: U10.P6(BITE) U10AL.4(BITE) ; off-sheet MAC_BITE
MAC_PPS_IN0+: R17.2 U10.5(PPS-IN_0+) U10AL.9(1_PPS_IN) ; off-sheet MAC_PPS_IN0+, off-sheet MAC_PPSin  [also labelled MAC_PPSin]
MAC_PPS_IN0-: U10.7(PPS-IN_0-) ; off-sheet MAC_PPS_IN0-
MAC_PPS_IN1+: U10.1(PPS-IN_1+) ; off-sheet MAC_PPS_IN1+
MAC_PPS_IN1-: U10.3(PPS-IN_1-) ; off-sheet MAC_PPS_IN1-
MAC_PPS_OUT+: U10.17(PPS-OUT_+) U10AL.10(1_PPS_OUT) ; off-sheet MAC_PPS_OUT+, off-sheet MAC_PPSout  [also labelled MAC_PPSout]
MAC_PPS_OUT-: U10.19(PPS-OUT_-) ; off-sheet MAC_PPS_OUT-
MAC_RX: U10.P7(RS-232_TX) U10AL.6(RX) ; off-sheet MAC_RX
MAC_TX: U10.P8(RS-232_RX) U10AL.5(TX) ; off-sheet MAC_TX
MAC_USB+: U10.2(USB_DATA_+) ; off-sheet MAC_USB+
MAC_USB-: U10.4(USB_DATA_-) ; off-sheet MAC_USB-
MAC_USB_PWR: U10.6(USB_POWER) ; off-sheet MAC_USB_PWR
OE_5356: U13.1(OE) ; off-sheet OE_5356
RTC_MFP: U3.3(~{INT}/SQW) ; off-sheet RTC_MFP
SCL: U3.16(SCL) U11.3(SCL) U13.2(SCL) ; off-sheet SCL
SDA: U3.15(SDA) U11.4(SDA) U13.10(SDA) ; off-sheet SDA
NetBT1_2: BT1.2(A) U3.14(VBAT)
NetC72_2: C72.2 C73.2 FB2.2 FB3.1
NetR42_1: R42.1 U13.5(A0)

Not connected (* = marked no-connect by the designer): U3 1(32kHz)* 4(~{RST})*; U10 10(NC)* 11(NC)* 12(NC)* 13(NC)* 14(NC)* 16(NC)* 18(NC)*; U10AL 1(TUNE)*; U11 1(NC)* 7(NC)* 8(NC)*; U13 3(NC)* 7(NC)* 8(NC)*

### Notes on the sheet
- (near U3) RTC
- MAC
- SHEET
- timingcard.com <http://timingcard.com>
- OF
- (in symbol CMP-136216-000002-1) +; -

### Library data of the parts
BT1 = CMP-136216-000002-1: BATTERY HOLDER COIN 20MM SMD; Number of Cells: 1; Termination: SMD/SMT; Mount: Surface Mount; Max Operating Temperature: 280°C; Min Operating Temperature: -40°C; Package Quantity: 400; Case/Package: SMD/SMT
C62 = CAP_0805_10UF_25V: as C1 on sheet POWER; MODIFY DATE: 10/23/2013; CATEGORY: CAP, CER; Date: 4/11/2006 3:37:28 PM; SHEETPART: *; P1: 10%; P2: 25V; P3: X5R; Size: 0805; Supplier 1: MOUSER; Supplier Part Number 1: 963-TMK212BBJ106KG-T
C63 C66 C77-C83 = CMP-2006-00003-1: C0603X104K5RACAUTO; Manufacturer: Kemet; Part Number: C0603X104K5RACAUTO
C65 C84 = CAP_0805_1UF_50V: CAP, CER, 1.0UF, 50V, 10%, X7R, 0805; MFG PART NUM: GCM21BR71H105KA03L; VALENTIUM PART NUM: <VALENTIUM>; MFG NAME: MURATA; MAXTEMP: 125C; MINTEMP: -55C; OTHER: AEC-Q200; MODIFY DATE: 10/23/2013; CATEGORY: CAP, CER; Date: 10/31/2006 2:46:38 PM; SHEETPART: *; P1: 10%; P2: 50V; P3: X7R; Size: 0805; DESC: CAP, CER, 1.0UF, 50V, 10%, X7R, 0805; Supplier 1: Digi-Key; Supplier Part Number 1: 490-10675-1-ND
C67 C76 = CAP_0603_0.01UF_50V: as C3 on sheet POWER; CATEGORY: CAP, CER; MODIFY DATE: 10/23/2013; Date: 7/24/2013; SHEETPART: *; P1: 10%; P2: 50V; P3: X7R; Size: 0603; Supplier 1: Digi-Key; Supplier Part Number 1: 399-1091-1-ND; DESC: CAP, CER, 0.01UF, 50V, 10%, X7R, 0603
C72-C75 = CAP_0805_22UF_16V: CAP, CER, 22.UF, 16V, 20%, X5R, 0805; MFG PART NUM: GRM219R61C226ME15L; VALENTIUM PART NUM: <VALENTIUM>; MFG NAME: MURATA; MAXTEMP: 85C; MINTEMP: -55C; MODIFY DATE: 10/23/2013; CATEGORY: CAP, CER; Date: 4/11/2006 3:37:28 PM; SHEETPART: *; P1: 20%; P2: 16V; P3: X5R; Size: 0805; DESC: CAP, CER, 22.UF, 16V, 20%, X5R, 0805; Supplier 1: Digi-Key; Supplier Part Number 1: 490-9952-1-ND
FB2 FB3 = MPZ1608_220OHM_0603: FER, 220 OHM, 100MHZ, 2.2A, 0.05OHM DC, MPZ1608, 0603; MFG PART NUM: MPZ1608S221ATA00; VALENTIUM PART NUM: <VALENTIUM>; MFG NAME: TDK CORP; MAXTEMP: 125C; MINTEMP: -55C; MODIFY DATE: 9/4/2013; CATEGORY: FERRITE; Date: 8/6/2013; P1: 100MHZ; P2: 2.2A; P3: 0.05 OHM; SIZE: 0603; SHEETPART: *; DESC: FER, 220 OHM, 100MHZ, 2.2A, 0.05OHM DC, MPZ1608, 0603; OTHER: MPZ1608; Supplier 1: Digi-Key
R17 = Res3: Resistor; Published: 8-Jun-2000; LatestRevisionDate: 29-May-2009; LatestRevisionNote: IPC-7351 Footprint Added.; PackageReference: J1-0603; Publisher: Altium Limited; PackageDescription: Chip Resistor
R42 = RES_0603_10K: as R33 on sheet USER_IO; ModifyDate: 7/25/2013; MFG PART NUM: ERJ-3EKF1002V; CATEGORY: RES; Date: 7/26/2013; P1: 1%; P3: TF; P2: 1/10W; SIZE: 0603; Supplier 1: Digi-Key; Supplier Part Number 1: P10.0KHCT-ND; SHEETPART: *; DESC: RES, 10K, 1%, 1/10W, TF, 0603
U3 = CMP-0254-00293-1: Extremely Accurate I2C-Integrated Real-Time Clock/TCXO/Crystal, 16-Pin SO, -40 to 85 degC; ComponentLink1Description: Manufacturer URL; ComponentLink3URL: http://pdfserv.maxim-ic.com/package_dwgs/21-0042.PDF; ComponentLink3Description: Package Specification; PackageVersion: revD, 2010; ComponentLink2URL: http://datasheets.maxim-ic.com/en/ds/DS3231.pdf; ComponentLink2Description: Datasheet; PackageReference: W16-H2; Code_JEDEC: MS-013-AA; ComponentLink1URL: http://www.maxim-ic.com; PackageDescription: 16-Pin Small-Outline IC, Wide (0.3in), 1.27 mm Pitch, SOIC (W); Code_IPC: SOIC127P1030-16; DatasheetVersion: Rev 8, Jul-2010
U10 = MAC-SA5X: MOD, MAC, MAC-SA5X, ATOMIC CLOCK; VELENTIUM PART NUM: <V PART NUM>; MFG NAME: MICROCHIP; MAXTEMP: 85C; MINTEMP: -40C; OTHER: AEC-Q200; MODIFY DATE: 3/22/2006 1:36:44 PM; MFG PART NUM: MAC-SA5X; CATEGORY: MOD; P1: ATOMIC CLOCK; SHEETPART: *; DESC: MOD, MAC, MAC-SA5X, ATOMIC CLOCK
U10AL = CMP-2000-07612-1: Quantum(TM) Miniature Chip Scale Atomic Clock, 3.3 V, 10 MHz, -10 to 70 degC, 9-Pin THD, RoHS, Bulk; Manufacturer: Microsemi; Package Description: 9-Pin Through Hole Device, Body 40.64 x 35.306 mm; Manufacturer URL: http://www.microsemi.com/; Datasheet Version: 03/2017; Package Reference: 090-02984-00X; Datasheet URL: https://media.digikey.com/pdf/Data%20Sheets/Microsemi%20PDFs/090-02984-001.pdf; Mounting Technology: ThroughHole
U11 = SiT5721AI-KWA33-T-10.000000: OSC, 10MHZ, 3.3V, 5PPB, DCOCXO, SMT; VELENTIUM PART NUM: <V PART NUM>; MFG NAME: SITIME; MAXTEMP: 85C; MINTEMP: -30C; MFG PART NUM: SiT5721AI-KWA33-T-10.000000; MODIFY DATE: 9/18/2013; CATEGORY: OSC; Date: 9/18/2013; P1: OSC; P2: 3.3V; P3: 5PPB; SIZE: 9.0X7.0MM; SHEETPART: *; DESC: OSC, 10MHZ, 3.3V, 5PPB, DCOCXO, SMT
U13 = SiT5356AI-FQA33-IT-10.000000: OSC, 10MHZ, 3.3V, 100PPB, DCTCXO, SMT; VELENTIUM PART NUM: <V PART NUM>; MFG NAME: SITIME; MAXTEMP: 85C; MINTEMP: -30C; MFG PART NUM: SiT5356AI-FQA33-IT-10.000000; MODIFY DATE: 9/18/2013; CATEGORY: OSC; Date: 9/18/2013; P1: OSC; P2: 3.3V; P3: 100PPB; SIZE: 5.0X3.2MM; SHEETPART: *; DESC: OSC, 10MHZ, 3.3V, 100PPB, DCTCXO, SMT

## Sheet FPGA.SchDoc: Grandmaster FPGA Connectors
size Tabloid; Author: N Smith; Revision: A; SheetNumber: 7; SheetTotal: 7; Customer: 01910
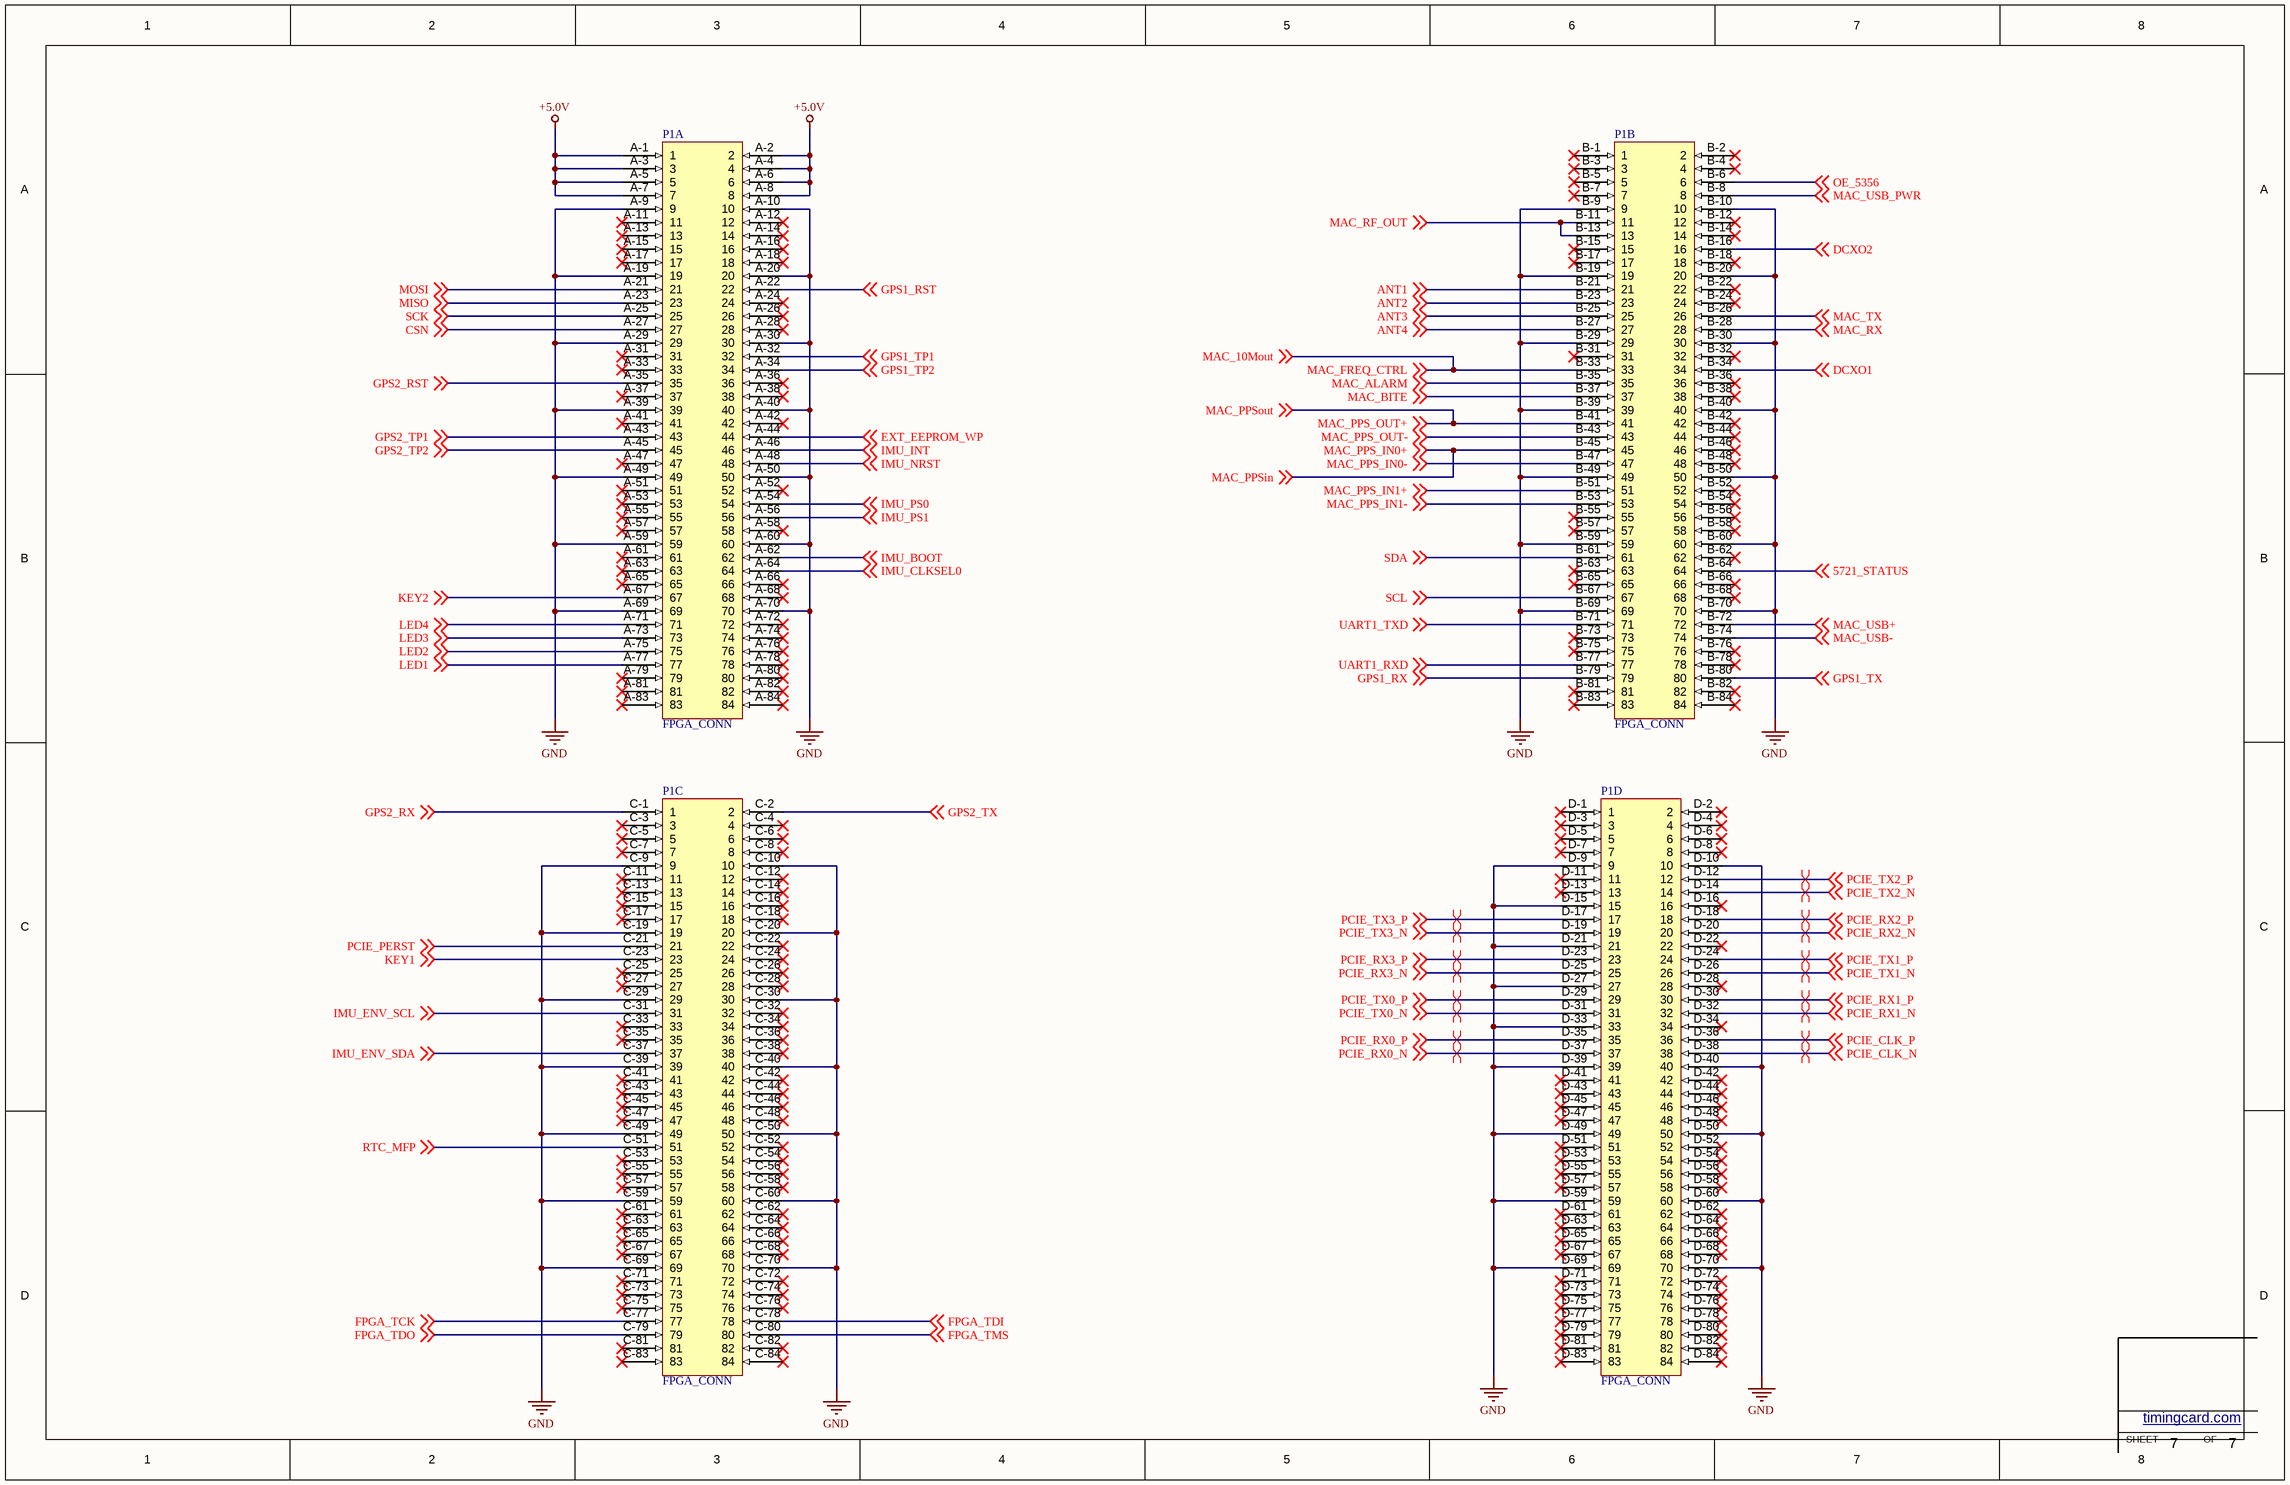
[diagram p3: FPGA.SchDoc]

### Parts
P1  FPGA_CONN  [FPGA_CONN]  (parts A,B,C,D of 4)

### Nets
+5.0V: P1.A-1(1) P1.A-2(2) P1.A-3(3) P1.A-4(4) P1.A-5(5) P1.A-6(6) P1.A-7(7) P1.A-8(8)
GND: P1.A-9(9) P1.A-10(10) P1.A-19(19) P1.A-20(20) P1.A-29(29) P1.A-30(30) P1.A-39(39) P1.A-40(40) P1.A-49(49) P1.A-50(50) P1.A-59(59) P1.A-60(60) P1.A-69(69) P1.A-70(70) P1.B-9(9) P1.B-10(10) P1.B-19(19) P1.B-20(20) P1.B-29(29) P1.B-30(30) P1.B-39(39) P1.B-40(40) P1.B-49(49) P1.B-50(50) P1.B-59(59) P1.B-60(60) P1.B-69(69) P1.B-70(70) P1.C-9(9) P1.C-10(10) P1.C-19(19) P1.C-20(20) P1.C-29(29) P1.C-30(30) P1.C-39(39) P1.C-40(40) P1.C-49(49) P1.C-50(50) P1.C-59(59) P1.C-60(60) P1.C-69(69) P1.C-70(70) P1.D-9(9) P1.D-10(10) P1.D-15(15) P1.D-21(21) P1.D-27(27) P1.D-33(33) P1.D-39(39) P1.D-40(40) P1.D-49(49) P1.D-50(50) P1.D-59(59) P1.D-60(60) P1.D-69(69) P1.D-70(70)
5721_STATUS: P1.B-64(64) ; off-sheet 5721_STATUS
ANT1: P1.B-21(21) ; off-sheet ANT1
ANT2: P1.B-23(23) ; off-sheet ANT2
ANT3: P1.B-25(25) ; off-sheet ANT3
ANT4: P1.B-27(27) ; off-sheet ANT4
CSN: P1.A-27(27) ; off-sheet CSN
DCXO1: P1.B-34(34) ; off-sheet DCXO1
DCXO2: P1.B-16(16) ; off-sheet DCXO2
EXT_EEPROM_WP: P1.A-44(44) ; off-sheet EXT_EEPROM_WP
FPGA_TCK: P1.C-77(77) ; off-sheet FPGA_TCK
FPGA_TDI: P1.C-78(78) ; off-sheet FPGA_TDI
FPGA_TDO: P1.C-79(79) ; off-sheet FPGA_TDO
FPGA_TMS: P1.C-80(80) ; off-sheet FPGA_TMS
GPS1_RST: P1.A-22(22) ; off-sheet GPS1_RST
GPS1_RX: P1.B-79(79) ; off-sheet GPS1_RX
GPS1_TP1: P1.A-32(32) ; off-sheet GPS1_TP1
GPS1_TP2: P1.A-34(34) ; off-sheet GPS1_TP2
GPS1_TX: P1.B-80(80) ; off-sheet GPS1_TX
GPS2_RST: P1.A-35(35) ; off-sheet GPS2_RST
GPS2_RX: P1.C-1(1) ; off-sheet GPS2_RX
GPS2_TP1: P1.A-43(43) ; off-sheet GPS2_TP1
GPS2_TP2: P1.A-45(45) ; off-sheet GPS2_TP2
GPS2_TX: P1.C-2(2) ; off-sheet GPS2_TX
IMU_BOOT: P1.A-62(62) ; off-sheet IMU_BOOT
IMU_CLKSEL0: P1.A-64(64) ; off-sheet IMU_CLKSEL0
IMU_ENV_SCL: P1.C-31(31) ; off-sheet IMU_ENV_SCL
IMU_ENV_SDA: P1.C-37(37) ; off-sheet IMU_ENV_SDA
IMU_INT: P1.A-46(46) ; off-sheet IMU_INT
IMU_NRST: P1.A-48(48) ; off-sheet IMU_NRST
IMU_PS0: P1.A-54(54) ; off-sheet IMU_PS0
IMU_PS1: P1.A-56(56) ; off-sheet IMU_PS1
KEY1: P1.C-23(23) ; off-sheet KEY1
KEY2: P1.A-67(67) ; off-sheet KEY2
LED1: P1.A-77(77) ; off-sheet LED1
LED2: P1.A-75(75) ; off-sheet LED2
LED3: P1.A-73(73) ; off-sheet LED3
LED4: P1.A-71(71) ; off-sheet LED4
MAC_10Mout: P1.B-11(11) P1.B-13(13) P1.B-33(33) ; off-sheet MAC_FREQ_CTRL, off-sheet MAC_RF_OUT, off-sheet MAC_10Mout  [also labelled MAC_FREQ_CTRL, MAC_RF_OUT]
MAC_ALARM: P1.B-35(35) ; off-sheet MAC_ALARM
MAC_BITE: P1.B-37(37) ; off-sheet MAC_BITE
MAC_PPS_IN0+: P1.B-45(45) ; off-sheet MAC_PPS_IN0+, off-sheet MAC_PPSin  [also labelled MAC_PPSin]
MAC_PPS_IN0-: P1.B-47(47) ; off-sheet MAC_PPS_IN0-
MAC_PPS_IN1+: P1.B-51(51) ; off-sheet MAC_PPS_IN1+
MAC_PPS_IN1-: P1.B-53(53) ; off-sheet MAC_PPS_IN1-
MAC_PPS_OUT+: P1.B-41(41) ; off-sheet MAC_PPS_OUT+, off-sheet MAC_PPSout  [also labelled MAC_PPSout]
MAC_PPS_OUT-: P1.B-43(43) ; off-sheet MAC_PPS_OUT-
MAC_RX: P1.B-28(28) ; off-sheet MAC_RX
MAC_TX: P1.B-26(26) ; off-sheet MAC_TX
MAC_USB+: P1.B-72(72) ; off-sheet MAC_USB+
MAC_USB-: P1.B-74(74) ; off-sheet MAC_USB-
MAC_USB_PWR: P1.B-8(8) ; off-sheet MAC_USB_PWR
MISO: P1.A-23(23) ; off-sheet MISO
MOSI: P1.A-21(21) ; off-sheet MOSI
OE_5356: P1.B-6(6) ; off-sheet OE_5356
PCIE_CLK_N: P1.D-38(38) ; off-sheet PCIE_CLK_N
PCIE_CLK_P: P1.D-36(36) ; off-sheet PCIE_CLK_P
PCIE_PERST: P1.C-21(21) ; off-sheet PCIE_PERST
PCIE_RX0_N: P1.D-37(37) ; off-sheet PCIE_RX0_N
PCIE_RX0_P: P1.D-35(35) ; off-sheet PCIE_RX0_P
PCIE_RX1_N: P1.D-32(32) ; off-sheet PCIE_RX1_N
PCIE_RX1_P: P1.D-30(30) ; off-sheet PCIE_RX1_P
PCIE_RX2_N: P1.D-20(20) ; off-sheet PCIE_RX2_N
PCIE_RX2_P: P1.D-18(18) ; off-sheet PCIE_RX2_P
PCIE_RX3_N: P1.D-25(25) ; off-sheet PCIE_RX3_N
PCIE_RX3_P: P1.D-23(23) ; off-sheet PCIE_RX3_P
PCIE_TX0_N: P1.D-31(31) ; off-sheet PCIE_TX0_N
PCIE_TX0_P: P1.D-29(29) ; off-sheet PCIE_TX0_P
PCIE_TX1_N: P1.D-26(26) ; off-sheet PCIE_TX1_N
PCIE_TX1_P: P1.D-24(24) ; off-sheet PCIE_TX1_P
PCIE_TX2_N: P1.D-14(14) ; off-sheet PCIE_TX2_N
PCIE_TX2_P: P1.D-12(12) ; off-sheet PCIE_TX2_P
PCIE_TX3_N: P1.D-19(19) ; off-sheet PCIE_TX3_N
PCIE_TX3_P: P1.D-17(17) ; off-sheet PCIE_TX3_P
RTC_MFP: P1.C-51(51) ; off-sheet RTC_MFP
SCK: P1.A-25(25) ; off-sheet SCK
SCL: P1.B-67(67) ; off-sheet SCL
SDA: P1.B-61(61) ; off-sheet SDA
UART1_RXD: P1.B-77(77) ; off-sheet UART1_RXD
UART1_TXD: P1.B-71(71) ; off-sheet UART1_TXD

Not connected (* = marked no-connect by the designer): P1 A-11(11)* A-12(12)* A-13(13)* A-14(14)* A-15(15)* A-16(16)* A-17(17)* A-18(18)* A-24(24)* A-26(26)* A-28(28)* A-31(31)* A-33(33)* A-36(36)* A-37(37)* A-38(38)* A-41(41)* A-42(42)* A-47(47)* A-51(51)* A-52(52)* A-53(53)* A-55(55)* A-57(57)* A-58(58)* A-61(61)* A-63(63)* A-65(65)* A-66(66)* A-68(68)* A-72(72)* A-74(74)* A-76(76)* A-78(78)* A-79(79)* A-80(80)* A-81(81)* A-82(82)* A-83(83)* A-84(84)* B-1(1)* B-2(2)* B-3(3)* B-4(4)* B-5(5)* B-7(7)* B-12(12)* B-14(14)* B-15(15)* B-17(17)* B-18(18)* B-22(22)* B-24(24)* B-31(31)* B-32(32)* B-36(36)* B-38(38)* B-42(42)* B-44(44)* B-46(46)* B-48(48)* B-52(52)* B-54(54)* B-55(55)* B-56(56)* B-57(57)* B-58(58)* B-62(62)* B-63(63)* B-65(65)* B-66(66)* B-68(68)* B-73(73)* B-75(75)* B-76(76)* B-78(78)* B-81(81)* B-82(82)* B-83(83)* B-84(84)* C-3(3)* C-4(4)* C-5(5)* C-6(6)* C-7(7)* C-8(8)* C-11(11)* C-12(12)* C-13(13)* C-14(14)* C-15(15)* C-16(16)* C-17(17)* C-18(18)* C-22(22)* C-24(24)* C-25(25)* C-26(26)* C-27(27)* C-28(28)* C-32(32)* C-33(33)* C-34(34)* C-35(35)* C-36(36)* C-38(38)* C-41(41)* C-42(42)* C-43(43)* C-44(44)* C-45(45)* C-46(46)* C-47(47)* C-48(48)* C-52(52)* C-53(53)* C-54(54)* C-55(55)* C-56(56)* C-57(57)* C-58(58)* C-61(61)* C-62(62)* C-63(63)* C-64(64)* C-65(65)* C-66(66)* C-67(67)* C-68(68)* C-71(71)* C-72(72)* C-73(73)* C-74(74)* C-75(75)* C-76(76)* C-81(81)* C-82(82)* C-83(83)* C-84(84)* D-1(1)* D-2(2)* D-3(3)* D-4(4)* D-5(5)* D-6(6)* D-7(7)* D-8(8)* D-11(11)* D-13(13)* D-16(16)* D-22(22)* D-28(28)* D-34(34)* D-41(41)* D-42(42)* D-43(43)* D-44(44)* D-45(45)* D-46(46)* D-47(47)* D-48(48)* D-51(51)* D-52(52)* D-53(53)* D-54(54)* D-55(55)* D-56(56)* D-57(57)* D-58(58)* D-61(61)* D-62(62)* D-63(63)* D-64(64)* D-65(65)* D-66(66)* D-67(67)* D-68(68)* D-71(71)* D-72(72)* D-73(73)* D-74(74)* D-75(75)* D-76(76)* D-77(77)* D-78(78)* D-79(79)* D-80(80)* D-81(81)* D-82(82)* D-83(83)* D-84(84)*

### Layout directives
differential pair: PCIE_CLK_N, PCIE_CLK_P, PCIE_RX0_N, PCIE_RX0_P, PCIE_RX1_N, PCIE_RX1_P, PCIE_RX2_N, PCIE_RX2_P, PCIE_RX3_N, PCIE_RX3_P, PCIE_TX0_N, PCIE_TX0_P, PCIE_TX1_N, PCIE_TX1_P, PCIE_TX2_N, PCIE_TX2_P, PCIE_TX3_N, PCIE_TX3_P

### Notes on the sheet
- SHEET
- timingcard.com <http://timingcard.com>
- OF

## Nets that join several sheets
+3.3V: USER_IO (6 pins), POWER (9 pins), MAC (FB2.1)
+5.0V: POWER (8 pins), MAC (C62.1 C63.2 U10.P5), FPGA (8 pins)
GND: USER_IO (30 pins), POWER (30 pins), MAC (28 pins), FPGA (56 pins)
5721_STATUS: MAC (U11.2), FPGA (P1.B-64)
ANT1: USER_IO (D16.A J6.2 J8.1 R15.2), FPGA (P1.B-21)
ANT2: USER_IO (D15.A J5.2 J7.1 R14.2), FPGA (P1.B-23)
ANT3: USER_IO (D17.A J9.2 J11.1 R31.2), FPGA (P1.B-25)
ANT4: USER_IO (D18.A J10.2 J12.1 R32.2), FPGA (P1.B-27)
DCXO1: MAC (U13.6), FPGA (P1.B-34)
DCXO2: MAC (U11.6), FPGA (P1.B-16)
GPS1_TP1: USER_IO (R32.1), MAC (R17.1), FPGA (P1.A-32)
KEY1: USER_IO (R35.1), FPGA (P1.C-23)
KEY2: USER_IO (R36.1), FPGA (P1.A-67)
LED1: USER_IO (R16.1), FPGA (P1.A-77)
LED2: USER_IO (R28.1), FPGA (P1.A-75)
LED3: USER_IO (R29.1), FPGA (P1.A-73)
LED4: USER_IO (R30.1), FPGA (P1.A-71)
MAC_10Mout: USER_IO (R31.1), MAC (U10.P1 U10.P3 U10AL.12), FPGA (P1.B-11 P1.B-13 P1.B-33)
MAC_ALARM: MAC (U10.20), FPGA (P1.B-35)
MAC_BITE: MAC (U10.P6 U10AL.4), FPGA (P1.B-37)
MAC_PPS_IN0+: USER_IO (R15.1), MAC (R17.2 U10.5 U10AL.9), FPGA (P1.B-45)
MAC_PPS_IN0-: MAC (U10.7), FPGA (P1.B-47)
MAC_PPS_IN1+: MAC (U10.1), FPGA (P1.B-51)
MAC_PPS_IN1-: MAC (U10.3), FPGA (P1.B-53)
MAC_PPS_OUT+: USER_IO (R14.1), MAC (U10.17 U10AL.10), FPGA (P1.B-41)
MAC_PPS_OUT-: MAC (U10.19), FPGA (P1.B-43)
MAC_RX: MAC (U10.P7 U10AL.6), FPGA (P1.B-28)
MAC_TX: MAC (U10.P8 U10AL.5), FPGA (P1.B-26)
MAC_USB+: MAC (U10.2), FPGA (P1.B-72)
MAC_USB-: MAC (U10.4), FPGA (P1.B-74)
MAC_USB_PWR: MAC (U10.6), FPGA (P1.B-8)
OE_5356: MAC (U13.1), FPGA (P1.B-6)
RTC_MFP: MAC (U3.3), FPGA (P1.C-51)
SCL: MAC (U3.16 U11.3 U13.2), FPGA (P1.B-67)
SDA: MAC (U3.15 U11.4 U13.10), FPGA (P1.B-61)